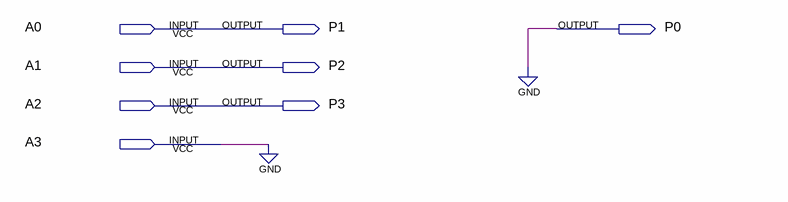
[diagram p0: schematic sheet]
// Quartus schematic multiplicador.bdf as structural Verilog: 0 symbols, 8 pins
module multiplicador (
  input  A0,
  input  A1,
  input  A2,
  input  A3,
  output P1,
  output P0,
  output P2,
  output P3
);


  assign P0 = 1'b0;
  assign P1 = A0;
  assign P2 = A1;
  assign P3 = A2;
  // also tied to GND on the sheet: A3
endmodule
